# EAGLE design core3 (EAGLE 6.6.0)

## Sheet 1 of 2
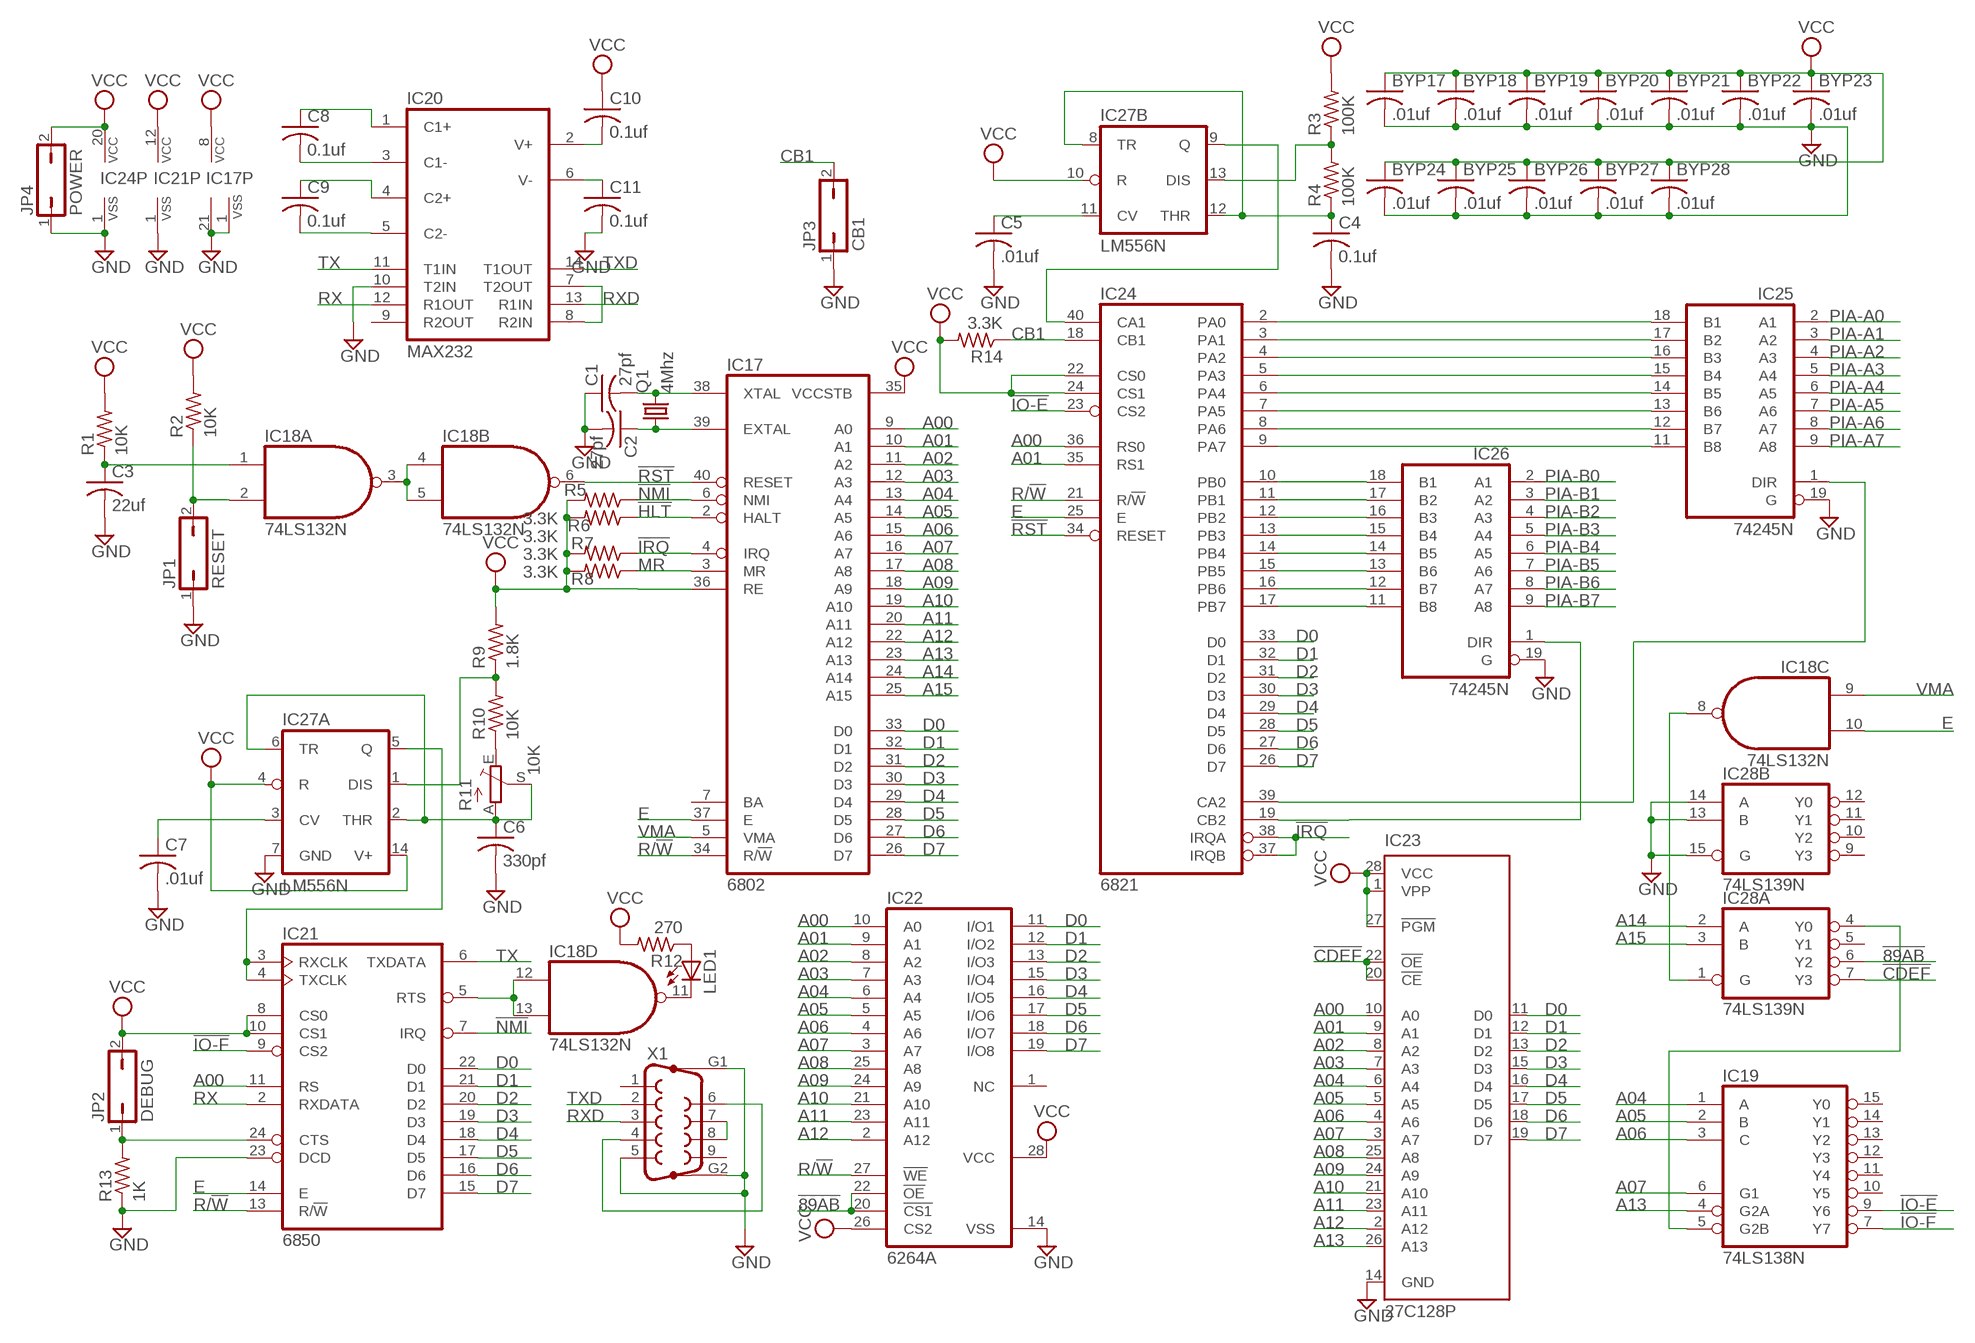
[diagram p0: schematic, sheet 1]

### Parts
BYP17  .01uf  C-US050-025X075  [C050-025X075]
BYP18  .01uf  C-US050-025X075  [C050-025X075]
BYP19  .01uf  C-US050-025X075  [C050-025X075]
BYP20  .01uf  C-US050-025X075  [C050-025X075]
BYP21  .01uf  C-US050-025X075  [C050-025X075]
BYP22  .01uf  C-US050-025X075  [C050-025X075]
BYP23  .01uf  C-US050-025X075  [C050-025X075]
BYP24  .01uf  C-US050-025X075  [C050-025X075]
BYP25  .01uf  C-US050-025X075  [C050-025X075]
BYP26  .01uf  C-US050-025X075  [C050-025X075]
BYP27  .01uf  C-US050-025X075  [C050-025X075]
BYP28  .01uf  C-US050-025X075  [C050-025X075]
C1  27pf  C-US050-025X075  [C050-025X075]
C2  27pf  C-US050-025X075  [C050-025X075]
C3  22uf  C-US102-043X133  [C102-043X133]
C4  0.1uf  C-US050-025X075  [C050-025X075]
C5  .01uf  C-US050-025X075  [C050-025X075]
C6  330pf  C-US050-025X075  [C050-025X075]
C7  .01uf  C-US050-025X075  [C050-025X075]
C8  0.1uf  C-US050-025X075  [C050-025X075]
C9  0.1uf  C-US050-025X075  [C050-025X075]
C10  0.1uf  C-US050-025X075  [C050-025X075]
C11  0.1uf  C-US050-025X075  [C050-025X075]
IC17  6802  [DIL40]
IC18  74LS132N  74LS00N  [DIL14]
IC19  74LS138N  [DIL16]
IC20  MAX232  [DIL16]
IC21  6850  [DIL24]
IC22  6264A  [DIL28-6]
IC23  27C128P  [DIL28-6]
IC24  6821  [DIL40]
IC25  74245N  74LS245N  [DIL20]
IC26  74245N  74LS245N  [DIL20]
IC27  LM556N  [DIL14]
IC28  74LS139N  [DIL16]
JP1  RESET  JP1Q  [JP1]
JP2  DEBUG  JP1Q  [JP1]
JP3  CB1  JP1Q  [JP1]
JP4  POWER  JP1Q  [JP1]
LED1  LED3MM  [LED3MM]
Q1  4Mhz  CRYSTALHC18U-V  [HC18U-V]
R1  10K  R-US_0207/7  [0207/7]
R2  10K  R-US_0207/7  [0207/7]
R3  100K  R-US_0207/7  [0207/7]
R4  100K  R-US_0207/7  [0207/7]
R5  3.3K  R-US_0207/7  [0207/7]
R6  3.3K  R-US_0207/7  [0207/7]
R7  3.3K  R-US_0207/7  [0207/7]
R8  3.3K  R-US_0207/7  [0207/7]
R9  1.8K  R-US_0207/7  [0207/7]
R10  10K  R-US_0207/7  [0207/7]
R11  10K  TRIM_EU-B90P  [SP19L]
R12  270  R-US_0207/7  [0207/7]
R13  1K  R-US_0207/7  [0207/7]
R14  3.3K  R-US_0207/7  [0207/7]
X1  F09HP  [F09HP]

### Nets
!89AB: IC22.20(!CS1) IC22.22(!OE) IC28.6(A:Y2)
!CDEF: IC23.20(!CE) IC23.22(!OE) IC28.7(A:Y3)
!HLT: IC17.2(HALT) R5.1
!IO-E: IC19.9(Y6) IC24.23(CS2)
!IO-F: IC19.7(Y7) IC21.9(CS2)
!IRQ: IC17.4(IRQ) IC24.37(IRQB) IC24.38(IRQA) R7.1
!NMI: IC17.6(NMI) IC21.7(IRQ) R6.1
!RST: IC17.40(RESET) IC18.6(B:O) IC24.34(RESET)
A00: IC17.9(A0) IC21.11(RS) IC22.10(A0) IC23.10(A0) IC24.36(RS0)
A01: IC17.10(A1) IC22.9(A1) IC23.9(A1) IC24.35(RS1)
A02: IC17.11(A2) IC22.8(A2) IC23.8(A2)
A03: IC17.12(A3) IC22.7(A3) IC23.7(A3)
A04: IC17.13(A4) IC19.1(A) IC22.6(A4) IC23.6(A4)
A05: IC17.14(A5) IC19.2(B) IC22.5(A5) IC23.5(A5)
A06: IC17.15(A6) IC19.3(C) IC22.4(A6) IC23.4(A6)
A07: IC17.16(A7) IC19.6(G1) IC22.3(A7) IC23.3(A7)
A08: IC17.17(A8) IC22.25(A8) IC23.25(A8)
A09: IC17.18(A9) IC22.24(A9) IC23.24(A9)
A10: IC17.19(A10) IC22.21(A10) IC23.21(A10)
A11: IC17.20(A11) IC22.23(A11) IC23.23(A11)
A12: IC17.22(A12) IC22.2(A12) IC23.2(A12)
A13: IC17.23(A13) IC19.4(G2A) IC23.26(A13)
A14: IC17.24(A14) IC28.2(A:A)
A15: IC17.25(A15) IC28.3(A:B)
CB1: IC24.18(CB1) JP3.2 R14.1
D0: IC17.33(D0) IC21.22(D0) IC22.11(I/O1) IC23.11(D0) IC24.33(D0)
D1: IC17.32(D1) IC21.21(D1) IC22.12(I/O2) IC23.12(D1) IC24.32(D1)
D2: IC17.31(D2) IC21.20(D2) IC22.13(I/O3) IC23.13(D2) IC24.31(D2)
D3: IC17.30(D3) IC21.19(D3) IC22.15(I/O4) IC23.15(D3) IC24.30(D3)
D4: IC17.29(D4) IC21.18(D4) IC22.16(I/O5) IC23.16(D4) IC24.29(D4)
D5: IC17.28(D5) IC21.17(D5) IC22.17(I/O6) IC23.17(D5) IC24.28(D5)
D6: IC17.27(D6) IC21.16(D6) IC22.18(I/O7) IC23.18(D6) IC24.27(D6)
D7: IC17.26(D7) IC21.15(D7) IC22.19(I/O8) IC23.19(D7) IC24.26(D7)
E: IC17.37(E) IC18.10(C:I1) IC21.14(E) IC24.25(E)
GND [Power]: BYP17.2 BYP18.2 BYP19.2 BYP20.2 BYP21.2 BYP22.2 BYP23.2 BYP24.2 BYP25.2 BYP26.2 BYP27.2 BYP28.2 C1.1 C2.2 C3.2 C4.2 C5.2 C6.2 C7.2 C11.2 IC17.1(VSS) IC17.21(VSS) IC20.10(T2IN) IC21.1(VSS) IC21.23(DCD) IC22.14(VSS) IC23.14(GND) IC24.1(VSS) IC25.19(G) IC26.19(G) IC27.7(A:GND) IC28.13(B:B) IC28.14(B:A) IC28.15(B:G) JP1.1 JP3.1 JP4.1 R13.1 X1.5 X1.G1 X1.G2 ; also sheet 2
MR: IC17.3(MR) R8.1
N$3: C2.1 IC17.39(EXTAL) Q1.1
N$4: C1.2 IC17.38(XTAL) Q1.2
N$5: IC24.2(PA0) IC25.18(B1)
N$6: IC18.3(A:O) IC18.4(B:I0) IC18.5(B:I1)
N$21: C3.1 IC18.1(A:I0) R1.1
N$22: IC18.2(A:I1) JP1.2 R2.1
N$23: IC21.3(RXCLK) IC21.4(TXCLK) IC27.5(A:Q)
N$24: IC24.10(PB0) IC26.18(B1)
N$25: IC24.11(PB1) IC26.17(B2)
N$27: C6.1 IC27.2(A:THR) IC27.6(A:TR) R11.A R11.S
N$28: IC27.1(A:DIS) R9.1 R10.2
N$94: IC24.12(PB2) IC26.16(B3)
N$124: IC24.13(PB3) IC26.15(B4)
N$125: IC24.14(PB4) IC26.14(B5)
N$126: IC24.15(PB5) IC26.13(B6)
N$127: IC24.16(PB6) IC26.12(B7)
N$128: IC24.17(PB7) IC26.11(B8)
N$129: IC24.3(PA1) IC25.17(B2)
N$130: IC24.4(PA2) IC25.16(B3)
N$131: IC24.5(PA3) IC25.15(B4)
N$132: IC24.6(PA4) IC25.14(B5)
N$133: IC24.7(PA5) IC25.13(B6)
N$134: IC24.8(PA6) IC25.12(B7)
N$135: IC24.9(PA7) IC25.11(B8)
N$136: IC24.19(CB2) IC26.1(DIR)
N$137: IC24.39(CA2) IC25.1(DIR)
N$138: IC24.40(CA1) IC27.9(B:Q)
N$140: C4.1 IC27.8(B:TR) IC27.12(B:THR) R4.1
N$141: IC27.13(B:DIS) R3.1 R4.2
N$142: C5.1 IC27.11(B:CV)
N$143: R10.1 R11.E
N$144: X1.4 X1.6
N$145: X1.7 X1.8
N$147: IC18.12(D:I0) IC18.13(D:I1) IC21.5(RTS)
N$148: IC18.11(D:O) LED1.K(C)
N$149: LED1.A R12.1
N$150: IC21.24(CTS) JP2.1 R13.2
N$151: IC18.8(C:O) IC28.1(A:G)
N$152: IC19.5(G2B) IC28.4(A:Y0)
N$153: IC20.7(T2OUT) IC20.8(R2IN)
N$154: C7.1 IC27.3(A:CV)
N$155: C9.2 IC20.5(C2-)
N$156: C9.1 IC20.4(C2+)
N$157: C8.2 IC20.3(C1-)
N$158: C8.1 IC20.1(C1+)
N$159: C11.1 IC20.6(V-)
N$160: C10.2 IC20.2(V+)
PIA-A0: IC25.2(A1) ; also sheet 2
PIA-A1: IC25.3(A2) ; also sheet 2
PIA-A2: IC25.4(A3) ; also sheet 2
PIA-A3: IC25.5(A4) ; also sheet 2
PIA-A4: IC25.6(A5) ; also sheet 2
PIA-A5: IC25.7(A6) ; also sheet 2
PIA-A6: IC25.8(A7) ; also sheet 2
PIA-A7: IC25.9(A8) ; also sheet 2
PIA-B0: IC26.2(A1) ; also sheet 2
PIA-B1: IC26.3(A2) ; also sheet 2
PIA-B2: IC26.4(A3) ; also sheet 2
PIA-B3: IC26.5(A4) ; also sheet 2
PIA-B4: IC26.6(A5) ; also sheet 2
PIA-B5: IC26.7(A6) ; also sheet 2
PIA-B6: IC26.8(A7) ; also sheet 2
PIA-B7: IC26.9(A8) ; also sheet 2
R/!W: IC17.34(R/!W) IC21.13(R/!W) IC22.27(!WE) IC24.21(R/!W)
RX: IC20.12(R1OUT) IC21.2(RXDATA)
RXD: IC20.13(R1IN) X1.3
TX: IC20.11(T1IN) IC21.6(TXDATA)
TXD: IC20.14(T1OUT) X1.2
VCC [Power]: BYP17.1 BYP18.1 BYP19.1 BYP20.1 BYP21.1 BYP22.1 BYP23.1 BYP24.1 BYP25.1 BYP26.1 BYP27.1 BYP28.1 C10.1 IC17.8(VCC) IC17.35(VCCSTB) IC17.36(RE) IC21.8(CS0) IC21.10(CS1) IC21.12(VCC) IC22.26(CS2) IC22.28(VCC) IC23.1(VPP) IC23.27(!PGM) IC23.28(VCC) IC24.20(VCC) IC24.22(CS0) IC24.24(CS1) IC27.4(A:R) IC27.10(B:R) IC27.14(A:V+) JP2.2 JP4.2 R1.2 R2.2 R3.2 R5.2 R6.2 R7.2 R8.2 R9.2 R12.2 R14.2 ; also sheet 2
VMA: IC17.5(VMA) IC18.9(C:I0)
Unconnected: IC17.7(BA) IC19.10(Y5) IC19.11(Y4) IC19.12(Y3) IC19.13(Y2) IC19.14(Y1) IC19.15(Y0) IC20.9(R2OUT) IC22.1(NC) IC28.5(A:Y1) IC28.9(B:Y3) IC28.10(B:Y2) IC28.11(B:Y1) IC28.12(B:Y0) X1.1 X1.9

## Sheet 2 of 2
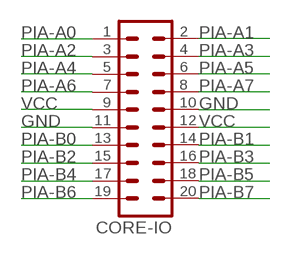
[diagram p1: schematic, sheet 2]

### Parts
CORE-IO  MA10-2  [MA10-2]

### Nets
GND [Power]: CORE-IO.10 CORE-IO.11 ; also sheet 1
PIA-A0: CORE-IO.1 ; also sheet 1
PIA-A1: CORE-IO.2 ; also sheet 1
PIA-A2: CORE-IO.3 ; also sheet 1
PIA-A3: CORE-IO.4 ; also sheet 1
PIA-A4: CORE-IO.5 ; also sheet 1
PIA-A5: CORE-IO.6 ; also sheet 1
PIA-A6: CORE-IO.7 ; also sheet 1
PIA-A7: CORE-IO.8 ; also sheet 1
PIA-B0: CORE-IO.13 ; also sheet 1
PIA-B1: CORE-IO.14 ; also sheet 1
PIA-B2: CORE-IO.15 ; also sheet 1
PIA-B3: CORE-IO.16 ; also sheet 1
PIA-B4: CORE-IO.17 ; also sheet 1
PIA-B5: CORE-IO.18 ; also sheet 1
PIA-B6: CORE-IO.19 ; also sheet 1
PIA-B7: CORE-IO.20 ; also sheet 1
VCC [Power]: CORE-IO.9 CORE-IO.12 ; also sheet 1

## Power pins joined to a net without a drawn wire
GND: IC18.7(P:GND) IC19.8(GND) IC20.15(GND) IC25.10(GND) IC26.10(GND) IC28.8(P:GND)
VCC: IC18.14(P:VCC) IC19.16(VCC) IC20.16(VCC) IC25.20(VCC) IC26.20(VCC) IC28.16(P:VCC)

## Library data of the parts
BYP17-BYP28 C1-C11 = rcl:C-US: CAPACITOR, American symbol
CORE-IO = con-lstb:MA10-2: PIN HEADER; OC_FARNELL: unknown; OC_NEWARK: unknown
IC17 = micro-motorola:6802: MICROCONTROLLER/MEMORY DEVICE; OC_FARNELL: unknown; OC_NEWARK: unknown
IC18 = 74xx-us:74*00: Quad 2-input NAND gate
IC19 = 74xx-us:74*138: 3-line to 8-line DECODER/DEMULTIPLEXER
IC20 = maxim:MAX232: RS232 TRANSCEIVER; MF: MAXIM; MPN: MAX232ACPE+; OC_FARNELL: 9723773; OC_NEWARK: 68K4544
IC21 = micro-motorola:6850: MICROCONTROLLER/MEMORY DEVICE; MF: NTE ELECTRONICS; MPN: NTE6850; OC_FARNELL: 4899775; OC_NEWARK: 31C2457
IC22 = memory-hitachi:6264A: MEMORY; OC_FARNELL: 283605; OC_NEWARK: unknown
IC23 = microchip:27*128: CMOS EPROM 128 K (16 K x 8); OC_FARNELL: unknown; OC_NEWARK: unknown
IC24 = micro-motorola:6821: MICROCONTROLLER/MEMORY DEVICE; MF: NTE ELECTRONICS; MPN: NTE6821; OC_FARNELL: 1652403; OC_NEWARK: 29C4772
IC25 IC26 = 74xx-us:74*245: Octal BUS TRANSCEIVER, 3-state
IC27 = linear:*556: Dual TIMER
IC28 = 74xx-us:74*139: Dual 2-line to 4-line DECODER/DEMULTIPLEXER
JP1-JP4 = jumper:JP1Q: JUMPER
LED1 = led:LED: LED OSRAM: - CHIPLED LG R971, LG N971, LY N971, LG Q971, LY Q971, LO R971, LY R971 LH N974, LH R974 LS Q976, LO Q976, LY Q976 LO Q996 - Hyper CHIPLED LW Q18S LB Q993, LB Q99A, LB R99A - SideLED LS A670, LO A670, LY A670, LG A670, LP A670 LB A673, LV A673, LT A673, LW A673 LH A674 LY A675 LS A676, LA A676, LO A676, LY A676, LW A676 LS A679, LY A679, LG A679 - Hyper Micro SIDELED® LS Y876, LA Y876, LO Y876, LY Y876 LT Y87S - SmartLED LW L88C, LW L88S LB L89C, LB L89S, LG L890 LS L89K, LO L89K, LY L89K LS L896, LA L896, LO L896, LY L896 - TOPLED LS T670, LO T670, LY T670, LG T670, LP T670 LSG T670, LSP T670, LSY T670, LOP T670, LYG T670 LG T671, LOG T671, LSG T671 LB T673, LV T673, LT T673, LW T673 LH T674 LS T676, LA T676, LO T676, LY T676, LB T676, LH T676, LSB T676, LW T676 LB T67C, LV T67C, LT T67C, LS T67K, LO T67K, LY T67K, LW E67C LS E67B, LA E67B, LO E67B, LY E67B, LB E67C, LV E67C, LT E67C LW T67C LS T679, LY T679, LG T679 LS T770, LO T770, LY T770, LG T770, LP T770 LB T773, LV T773, LT T773, LW T773 LH T774 LS E675, LA E675, LY E675, LS T675 LS T776, LA T776, LO T776, LY T776, LB T776 LHGB T686 LT T68C, LB T68C - Hyper Mini TOPLED® LB M676 - Mini TOPLED Santana® LG M470 LS M47K, LO M47K, LY M47K Source: http://www.osram.convergy.de LUXEON: - LUMILED® LXK2-PW12-R00, LXK2-PW12-S00, LXK2-PW14-U00, LXK2-PW14-V00 LXK2-PM12-R00, LXK2-PM12-S00, LXK2-PM14-U00 LXK2-PE12-Q00, LXK2-PE12-R00, LXK2-PE12-S00, LXK2-PE14-T00, LXK2-PE14-U00 LXK2-PB12-K00, LXK2-PB12-L00, LXK2-PB12-M00, LXK2-PB14-N00, LXK2-PB14-P00, LXK2-PB14-Q00 LXK2-PR12-L00, LXK2-PR12-M00, LXK2-PR14-Q00, LXK2-PR14-R00 LXK2-PD12-Q00, LXK2-PD12-R00, LXK2-PD12-S00 LXK2-PH12-R00, LXK2-PH12-S00 LXK2-PL12-P00, LXK2-PL12-Q00, LXK2-PL12-R00 Source: www.luxeon.com KINGBRIGHT: KA-3528ASYC Source: www.kingbright.com
Q1 = crystal:CRYSTAL: CRYSTAL; OC_FARNELL: unknown; OC_NEWARK: unknown
R1-R10 R12-R14 = rcl:R-US_: RESISTOR, American symbol
R11 = pot:TRIM_EU-: POTENTIOMETER
X1 = con-subd:F09HP: SUB-D; OC_FARNELL: unknown; OC_NEWARK: unknown

## Net classes
1 Power: width 0.508 mm, drill 0.254 mm, clearance 0.254 mm

## Board
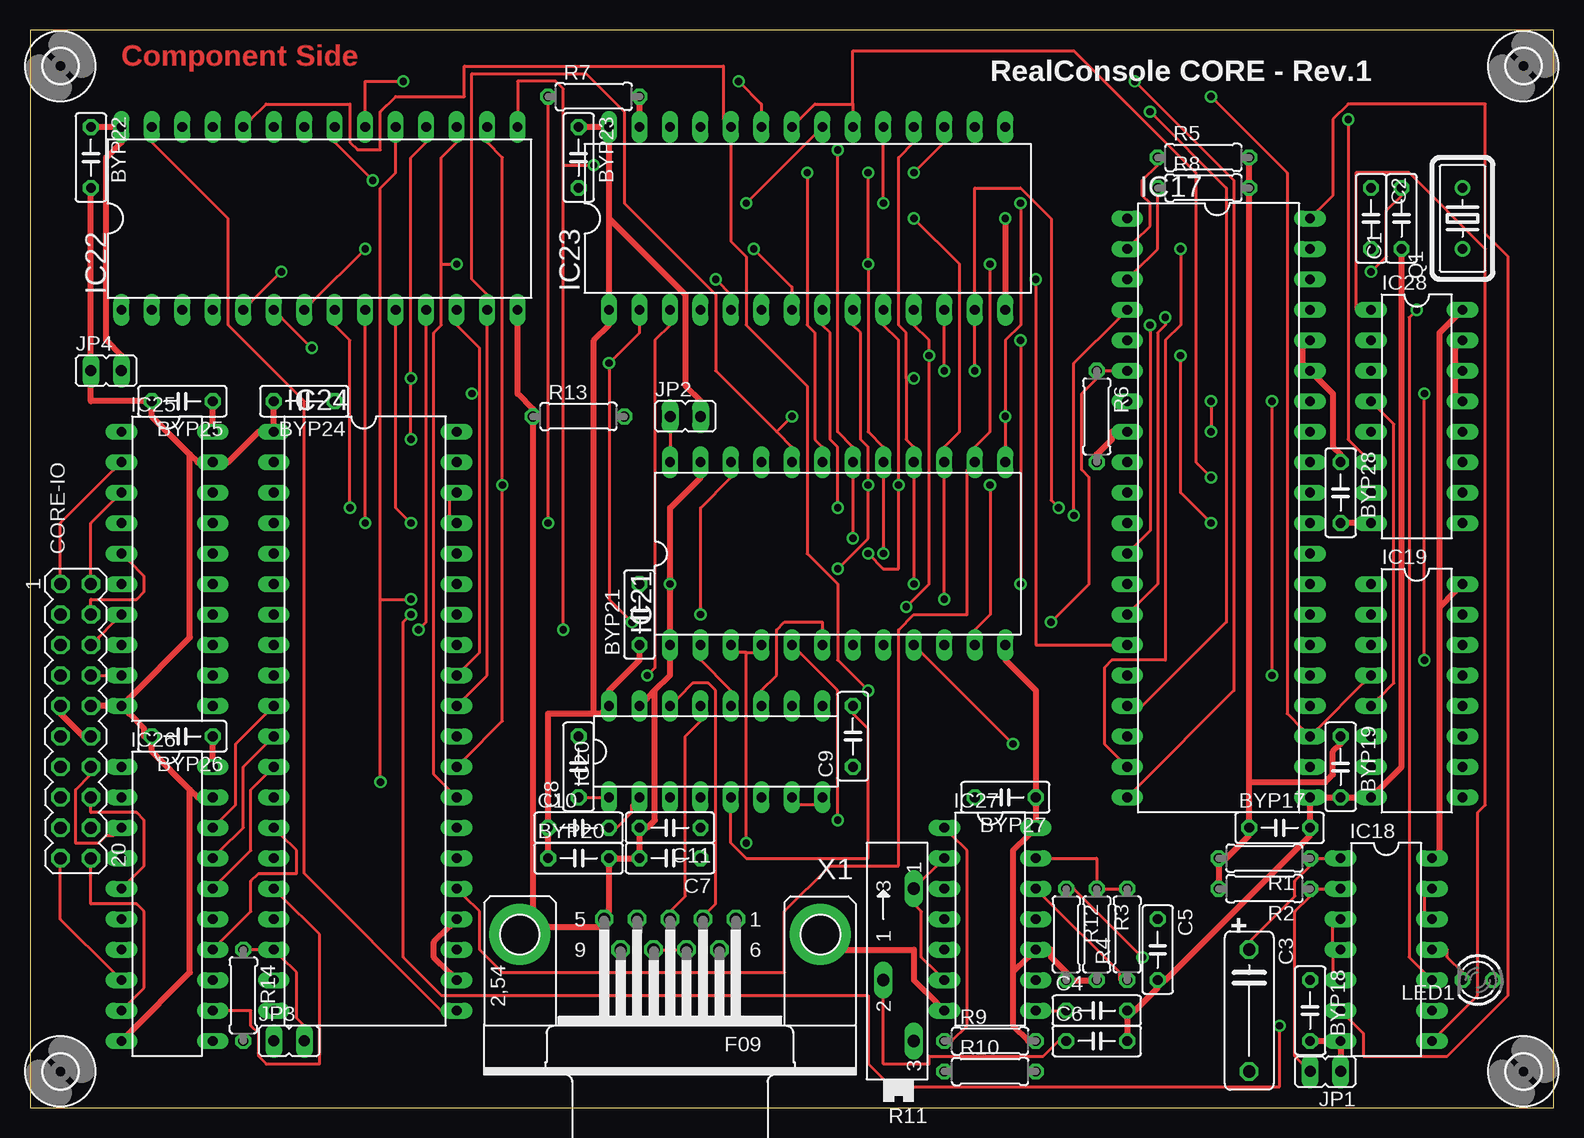
[diagram p2: board, top side]
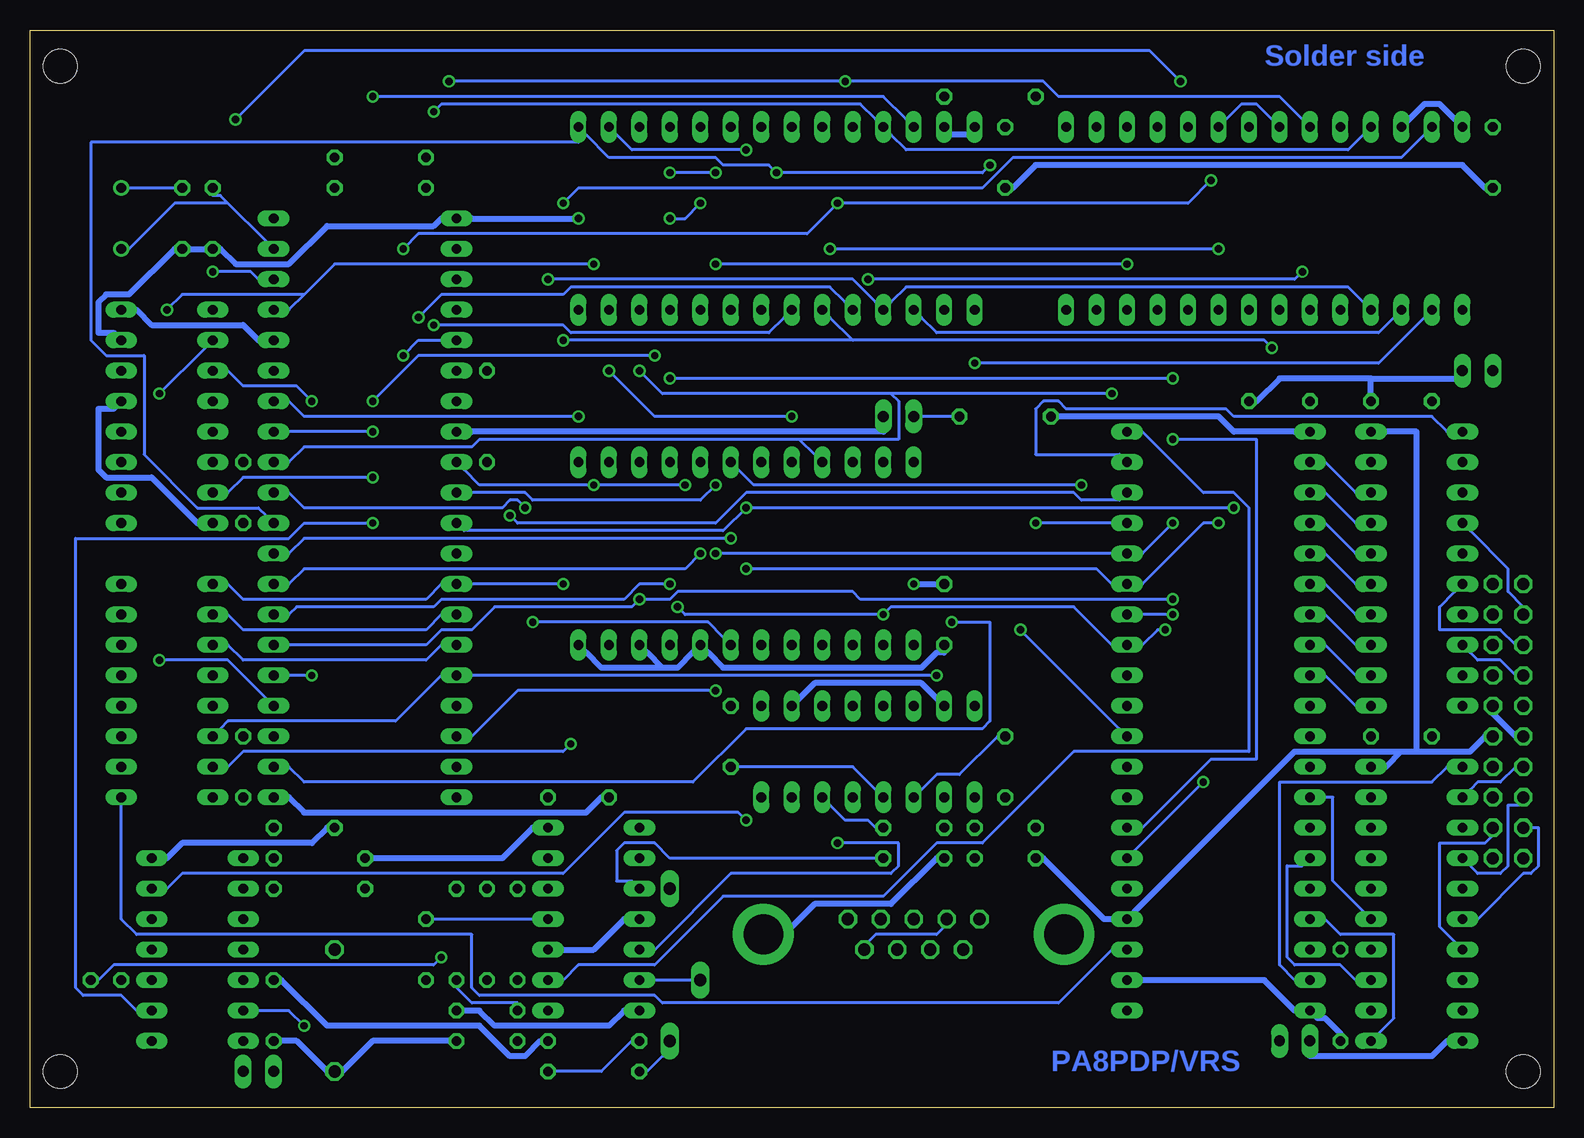
[diagram p3: board, bottom side, seen from below]

Size 126.98 x 89.84 mm. Coordinates in mm from the lower left corner, seen from the top.
Outline: 0,0 126.98,0 126.98,89.84 0,89.84 0,0
Copper layers (1*16): Top 0.035mm / dielectric 1.5mm / Bottom 0.035mm
Design rules "olimex10mil": minimum track width 10mil, minimum drill 24mil, track to track 10mil, track to pad 10mil, pad to pad 10mil, via to via 10mil, smd to smd 10mil, copper to edge 40mil, drill to drill 10mil, minimum pad ring 10mil, minimum via ring 8mil, stop-mask expansion 0mil, vias tented up to drill 0mil, thermal gap 10mil

### Footprints (pad centres in the part's own frame; a part is rotated, then mirrored left to right if it is on the bottom)
C050-025X075 = drill 0.813 octagon: 1 -2.54,0; 2 2.54,0
C102-043X133 = drill 1.016 octagon: 1 -5.08,0; 2 5.08,0
MA10-2 = drill 1.016 octagon: 1 -11.43,-1.27; 2 -11.43,1.27; 3 -8.89,-1.27; 4 -8.89,1.27; 5 -6.35,-1.27; 6 -6.35,1.27; 7 -3.81,-1.27; 8 -3.81,1.27; 9 -1.27,-1.27; 10 -1.27,1.27; 11 1.27,-1.27; 12 1.27,1.27; 13 3.81,-1.27; 14 3.81,1.27; 15 6.35,-1.27; 16 6.35,1.27; 17 8.89,-1.27; 18 8.89,1.27; 19 11.43,-1.27; 20 11.43,1.27
DIL40 = drill 0.813 long: 1 -24.13,-7.62; 2 -21.59,-7.62; 3 -19.05,-7.62; 4 -16.51,-7.62; 5 -13.97,-7.62; 6 -11.43,-7.62; 7 -8.89,-7.62; 8 -6.35,-7.62; 9 -3.81,-7.62; 10 -1.27,-7.62; 11 1.27,-7.62; 12 3.81,-7.62; 13 6.35,-7.62; 14 8.89,-7.62; 15 11.43,-7.62; 16 13.97,-7.62; 17 16.51,-7.62; 18 19.05,-7.62; 19 21.59,-7.62; 20 24.13,-7.62; 21 24.13,7.62; 22 21.59,7.62; 23 19.05,7.62; 24 16.51,7.62; 25 13.97,7.62; 26 11.43,7.62; 27 8.89,7.62; 28 6.35,7.62; 29 3.81,7.62; 30 1.27,7.62; 31 -1.27,7.62; 32 -3.81,7.62; 33 -6.35,7.62; 34 -8.89,7.62; 35 -11.43,7.62; 36 -13.97,7.62; 37 -16.51,7.62; 38 -19.05,7.62; 39 -21.59,7.62; 40 -24.13,7.62
DIL14 = drill 0.813 long: 1 -7.62,-3.81; 2 -5.08,-3.81; 3 -2.54,-3.81; 4 0,-3.81; 5 2.54,-3.81; 6 5.08,-3.81; 7 7.62,-3.81; 8 7.62,3.81; 9 5.08,3.81; 10 2.54,3.81; 11 0,3.81; 12 -2.54,3.81; 13 -5.08,3.81; 14 -7.62,3.81
DIL16 = drill 0.813 long: 1 -8.89,-3.81; 2 -6.35,-3.81; 3 -3.81,-3.81; 4 -1.27,-3.81; 5 1.27,-3.81; 6 3.81,-3.81; 7 6.35,-3.81; 8 8.89,-3.81; 9 8.89,3.81; 10 6.35,3.81; 11 3.81,3.81; 12 1.27,3.81; 13 -1.27,3.81; 14 -3.81,3.81; 15 -6.35,3.81; 16 -8.89,3.81
DIL24 = drill 0.813 long: 1 -13.97,-7.62; 2 -11.43,-7.62; 3 -8.89,-7.62; 4 -6.35,-7.62; 5 -3.81,-7.62; 6 -1.27,-7.62; 7 1.27,-7.62; 8 3.81,-7.62; 9 6.35,-7.62; 10 8.89,-7.62; 11 11.43,-7.62; 12 13.97,-7.62; 13 13.97,7.62; 14 11.43,7.62; 15 8.89,7.62; 16 6.35,7.62; 17 3.81,7.62; 18 1.27,7.62; 19 -1.27,7.62; 20 -3.81,7.62; 21 -6.35,7.62; 22 -8.89,7.62; 23 -11.43,7.62; 24 -13.97,7.62
DIL28-6 = drill 0.813 long: 1 -16.51,-7.62; 2 -13.97,-7.62; 3 -11.43,-7.62; 4 -8.89,-7.62; 5 -6.35,-7.62; 6 -3.81,-7.62; 7 -1.27,-7.62; 8 1.27,-7.62; 9 3.81,-7.62; 10 6.35,-7.62; 11 8.89,-7.62; 12 11.43,-7.62; 13 13.97,-7.62; 14 16.51,-7.62; 15 16.51,7.62; 16 13.97,7.62; 17 11.43,7.62; 18 8.89,7.62; 19 6.35,7.62; 20 3.81,7.62; 21 1.27,7.62; 22 -1.27,7.62; 23 -3.81,7.62; 24 -6.35,7.62; 25 -8.89,7.62; 26 -11.43,7.62; 27 -13.97,7.62; 28 -16.51,7.62
DIL20 = drill 0.813 long: 1 -11.43,-3.81; 2 -8.89,-3.81; 3 -6.35,-3.81; 4 -3.81,-3.81; 5 -1.27,-3.81; 6 1.27,-3.81; 7 3.81,-3.81; 8 6.35,-3.81; 9 8.89,-3.81; 10 11.43,-3.81; 11 11.43,3.81; 12 8.89,3.81; 13 6.35,3.81; 14 3.81,3.81; 15 1.27,3.81; 16 -1.27,3.81; 17 -3.81,3.81; 18 -6.35,3.81; 19 -8.89,3.81; 20 -11.43,3.81
JP1 = drill 0.914 long: 1 0,-1.27; 2 0,1.27
LED3MM = drill 0.813 octagon: A -1.27,0; K 1.27,0
HC18U-V = drill 0.813: 1 -2.54,0; 2 2.54,0
0207/7 = drill 0.813 octagon: 1 -3.81,0; 2 3.81,0
SP19L = drill 1.016 long: A 5.715,-1.27; E -6.985,-1.27; S -1.905,1.27
2,8 = hole 2.8: 0,0
F09HP = drill 1.016 octagon: 1 -5.486,-1.27; 2 -2.743,-1.27; 3 0,-1.27; 4 2.743,-1.27; 5 5.486,-1.27; 6 -4.115,1.27; 7 -1.372,1.27; 8 1.372,1.27; 9 4.115,1.27 | drill 3.302 pad 5.08: G1 -12.522,0; G2 12.522,0

### Placement (x,y rotation side)
BYP17  104.14,23.33 0 top
BYP18  106.68,8.09 270 top
BYP19  109.22,28.41 270 top
BYP20  45.71,20.79 0 top
BYP21  50.79,41.11 90 top
BYP22  5.08,79.21 270 top
BYP23  45.71,79.21 270 top
BYP24  22.86,58.89 180 top
BYP25  12.69,58.89 180 top
BYP26  12.69,30.95 180 top
BYP27  81.28,25.87 180 top
BYP28  109.22,51.27 270 top
C1  114.3,74.13 90 top
C2  111.76,74.13 270 top
C3  101.59,8.09 270 top
C4  88.9,8.09 0 top
C5  93.98,13.17 270 top
C6  88.9,5.55 0 top
C7  53.34,20.79 180 top
C8  45.71,28.41 90 top
C9  68.58,30.95 90 top
C10  45.71,23.33 0 top
C11  53.34,23.33 180 top
CORE-IO  3.81,32.22 270 top
IC17  99.06,50 270 top
IC18  113.03,13.17 270 top
IC19  115.56,34.76 270 top
IC20  57.14,29.68 0 top
IC21  67.31,46.19 0 top
IC22  24.12,74.13 0 top
IC23  64.77,74.13 0 top
IC24  27.94,32.22 270 top
IC25  11.42,44.92 270 top
IC26  11.42,16.98 270 top
IC27  80.01,15.71 270 top
IC28  115.56,57.62 270 top
JP1  107.95,3.01 90 top
JP2  54.6,57.62 270 top
JP3  21.59,5.55 270 top
JP4  6.34,61.43 270 top
LED1  120.65,10.63 180 top
Q1  119.38,74.13 90 top
R1  102.87,20.79 180 top
R2  102.87,18.25 180 top
R3  88.9,14.44 270 top
R4  91.44,14.44 90 top
R5  97.79,79.21 0 top
R6  88.9,57.62 270 top
R7  46.98,84.29 0 top
R8  97.79,76.67 0 top
R9  80.01,5.55 0 top
R10  80.01,3.01 0 top
R11  72.39,12.54 90 top
R12  86.36,14.44 270 top
R13  45.71,57.62 0 top
R14  17.78,9.36 270 top
U$3  [2,8]  2.54,86.83 0 top
U$4  [2,8]  2.54,3.01 0 top
U$5  [2,8]  124.45,86.83 0 top
U$6  [2,8]  124.45,3.01 0 top
X1  53.34,14.44 180 top

### Tracks (layer width: path | path; a pad name or v marks a point on that pad's centre or on a via)
!89AB  (via drill 0.61)
  Top 0.254: v109.85,82.39 109.85,55.71 111.12,54.45 IC28.6 | v31.11,85.56 27.94,85.56 27.94,83.02 IC22.20
  Bottom 0.254: IC22.22 23.49,82.39 24.76,83.66 26.03,83.66 27.3,82.39 IC22.20 | v109.85,82.39 104.14,88.1 33.65,88.1 v31.11,85.56
!CDEF  (via drill 0.61)
  Top 0.254: 68.58,83.66 65.4,83.66 64.13,82.39 IC23.22 | 68.58,83.66 68.58,83.02 IC23.20 | v98.42,52.54 97.15,53.81 97.15,77.94 86.99,88.1 68.58,88.1 68.58,83.66
  Bottom 0.254: v98.42,52.54 109.22,52.54 110.48,51.27 IC28.7
!HLT
  Top 0.254: IC17.2 92.07,72.22 93.34,73.5 93.34,75.4 92.7,76.03 92.7,77.3 93.98,78.58 R5.1
!IO-E
  Bottom 0.254: IC24.23 36.82,13.17 41.27,8.73 74.29,8.73 74.93,9.36 89.53,9.36 90.17,10 90.17,14.44 118.11,14.44 119.38,15.71 119.38,25.23 IC19.9
!IO-F  (via drill 0.61)
  Top 0.254: v81.91,30.31 74.29,37.94 IC21.9
  Bottom 0.254: v81.91,30.31 82.55,29.68 109.22,29.68 110.48,28.41 IC19.7
!IRQ  (via drill 0.61)
  Top 0.254: IC24.37 34.92,49.37 34.92,50.63 IC24.38 | v43.17,48.73 43.17,83.66 R7.1 | v86.99,49.37 86.99,62.06 90.8,65.88 IC17.4
  Bottom 0.254: v43.17,48.73 36.82,48.73 IC24.37 | v86.99,49.37 86.36,48.73 69.84,48.73 67.31,51.27 40,51.27 39.36,50.63 36.19,50.63 IC24.38
!NMI  (via drill 0.61)
  Top 0.254: v85.09,40.48 88.26,43.65 88.26,52.54 87.62,53.17 87.62,59.52 88.9,60.8 R6.1 89.53,61.43 90.17,61.43 IC17.6
  Bottom 0.254: v85.09,40.48 70.48,40.48 69.21,39.2 IC21.7
!RST  (via drill 0.61)
  Top 0.254: v31.75,41.11 31.11,40.48 31.11,12.54 34.28,9.36 69.84,9.36 69.84,3.64 71.75,1.74 104.14,1.74 v104.14,6.82 | IC17.40 107.31,74.77 108.58,76.03 108.58,82.39 109.85,83.66 121.28,83.66 121.28,72.86 123.19,70.95 123.19,9.36 118.11,4.28 111.12,4.28 111.12,6.18 109.85,7.46 IC18.6
  Bottom 0.254: v31.75,41.11 34.28,41.11 IC24.34 | v104.14,6.82 105.41,8.09 107.95,8.09 IC18.6
A00  (via drill 0.61)
  Top 0.254: v31.75,48.73 30.48,50 30.48,65.24 IC22.10 | v80.01,51.91 80.01,41.11 78.73,39.84 IC21.11 | IC23.10 71.12,65.24 72.39,63.97 v72.39,51.91 72.39,44.92 71.12,44.92 v69.84,46.19
  Bottom 0.254: v31.75,48.73 34.28,46.19 IC24.36 36.82,46.19 v69.84,46.19 | IC17.9 90.8,53.17 89.53,51.91 v80.01,51.91 v72.39,51.91
A01  (via drill 0.61)
  Top 0.254: v27.94,48.73 27.94,65.24 IC22.9 | IC23.9 68.58,65.24 69.21,64.61 69.21,55.71 69.84,55.08 v69.84,51.91 69.84,47.46 v67.31,44.92
  Bottom 0.254: v27.94,48.73 29.21,48.73 34.28,43.65 IC24.35 36.82,43.65 38.09,44.92 v67.31,44.92 | v69.84,51.91 71.12,50.63 85.09,50.63 85.72,51.27 90.17,51.27 IC17.10
A02  (via drill 0.61)
  Top 0.254: v26.67,50 26.67,63.97 25.39,65.24 IC22.8 | v67.31,50 67.31,55.08 66.67,55.71 66.67,64.61 66.04,65.24 IC23.8
  Bottom 0.254: v26.67,50 v67.31,50 69.21,48.09 90.8,48.09 IC17.11
A03  (via drill 0.61)
  Top 0.254: v27.94,71.59 23.49,67.14 IC22.7 | v60.32,71.59 63.49,68.41 63.49,67.78 IC23.7 | v93.34,65.24 93.34,48.09 92.07,46.82 IC17.12
  Bottom 0.254: v27.94,71.59 v60.32,71.59 | v93.34,65.24 82.55,65.24 81.91,64.61 65.4,64.61 64.13,65.88 IC23.7
A04  (via drill 0.61)
  Top 0.254: v23.49,63.34 20.95,65.88 IC22.6 | v82.55,63.97 v82.55,43.65
  Bottom 0.254: IC19.1 110.48,43.65 109.22,42.38 93.98,42.38 92.7,43.65 IC17.13 90.17,43.65 v82.55,43.65 | v23.49,63.34 24.12,63.97 58.41,63.97 | 58.41,63.97 60.32,65.88 IC23.6 | 58.41,63.97 v82.55,63.97
A05  (via drill 0.61)
  Top 0.254: v20.95,69.69 18.41,67.14 IC22.5 | v57.14,69.05 58.41,67.78 IC23.5 | v94.61,65.88 94.61,65.24 93.98,64.61 93.98,43.65 92.07,41.74 IC17.14
  Bottom 0.254: IC17.14 92.7,41.11 93.98,39.84 109.22,39.84 110.48,41.11 IC19.2 | v20.95,69.69 21.59,69.05 v57.14,69.05 | v94.61,65.88 92.7,67.78 82.55,67.78 81.91,68.41 60.32,68.41 59.05,67.14 IC23.5
A06  (via drill 0.61)
  Top 0.254: v83.81,69.05 83.81,38.57 90.17,38.57 IC17.15
  Bottom 0.254: IC17.15 92.7,38.57 93.98,37.3 109.22,37.3 110.48,38.57 IC19.3 | IC22.4 15.87,67.14 17.14,68.41 53.97,68.41 55.24,67.14 IC23.4 56.51,67.14 58.41,69.05 v83.81,69.05
A07  (via drill 0.61)
  Top 0.254: v51.43,36.03 52.06,36.66 52.06,63.97 53.34,65.24 IC23.3
  Bottom 0.254: IC19.6 111.12,31.58 110.48,32.22 96.52,32.22 92.7,36.03 IC17.16 90.17,36.03 v51.43,36.03 | IC22.3 13.33,65.88 14.6,64.61 51.43,64.61 52.7,65.88 IC23.3
A08  (via drill 0.61)
  Top 0.254: v93.34,83.02 99.69,76.67 99.69,40.48 92.7,33.49 IC17.17
  Bottom 0.254: IC22.25 15.87,81.11 17.14,79.84 53.97,79.84 55.24,81.11 IC23.25 56.51,82.39 57.78,83.66 92.7,83.66 v93.34,83.02
A09  (via drill 0.61)
  Top 0.254: IC22.24 18.41,82.39 19.68,83.66 26.67,83.66 26.67,80.48 27.3,79.84 29.21,79.84 29.21,83.02 30.48,84.29 36.19,84.29 36.19,86.83 57.78,86.83 57.78,82.39 IC23.24 58.41,80.48 58.41,72.22 59.68,70.95 59.68,65.24 64.77,60.16 64.77,46.19 67.31,43.65 67.31,37.3 v69.84,34.76
  Bottom 0.254: v69.84,34.76 86.36,34.76 90.17,30.95 IC17.18
A10  (via drill 0.61)
  Top 0.254: v28.57,77.3 25.39,80.48 IC22.21 | v59.68,75.4 65.4,81.11 IC23.21 | v95.88,71.59 95.88,65.24 94.61,63.97 94.61,37.3 90.17,37.3 89.53,36.66 89.53,30.31 90.8,29.04 IC17.19
  Bottom 0.254: v28.57,77.3 30.48,75.4 v59.68,75.4 62.22,72.86 94.61,72.86 v95.88,71.59
A11  (via drill 0.61)
  Top 0.254: v59.05,85.56 60.95,83.66 60.95,83.02 IC23.23 | v92.07,85.56 100.33,77.3 100.33,34.76 92.07,26.5 IC17.20
  Bottom 0.254: IC22.23 20.95,82.39 22.86,84.29 41.27,84.29 42.54,85.56 v59.05,85.56 v92.07,85.56
A12  (via drill 0.61)
  Top 0.254: IC23.2 50.79,65.24 50.79,64.61 v48.25,62.06 48.25,42.38 v50.16,40.48
  Bottom 0.254: v48.25,62.06 14.6,62.06 10.79,65.88 IC22.2 | v50.16,40.48 46.98,40.48 46.98,32.22 47.62,31.58 67.31,31.58 71.75,27.14 104.14,27.14 105.41,28.41 IC17.22
A13  (via drill 0.61)
  Top 0.254: v98.42,84.29 104.77,77.94 104.77,32.85 106.04,31.58 IC17.23 107.31,31.58 111.12,35.39 IC19.4
  Bottom 0.254: v98.42,84.29 55.88,84.29 53.97,82.39 IC23.26
A14  (via drill 0.61)
  Top 0.254: v116.2,37.3 v116.2,59.52
  Bottom 0.254: v116.2,37.3 110.48,37.3 107.31,34.12 IC17.24 | v116.2,59.52 112.39,63.34 IC28.2
A15  (via drill 0.61)
  Top 0.254: v103.5,36.03 v103.5,58.89
  Bottom 0.254: v103.5,36.03 105.41,36.03 IC17.25 | v103.5,58.89 104.77,60.16 109.22,60.16 110.48,61.43 IC28.3
CB1
  Top 0.254: R14.1 18.41,13.17 19.05,13.17 IC24.18 20.95,12.54 22.22,11.27 22.22,7.46 22.86,6.82 JP3.2
D0  (via drill 0.61)
  Top 0.254: v32.38,39.84 33.02,40.48 33.02,65.24 IC22.11 | v55.88,41.11 55.88,50 58.41,52.54 IC21.22 | v73.02,41.74 74.93,43.65 v74.93,62.7 74.93,63.97 73.66,65.24 IC23.11 | v98.42,58.89 v98.42,56.35
  Bottom 0.254: v32.38,39.84 33.02,39.84 34.28,38.57 IC24.33 36.82,38.57 40,41.74 55.24,41.74 v55.88,41.11 72.39,41.11 v73.02,41.74 | v98.42,56.35 105.41,56.35 IC17.33 | v98.42,58.89 94.61,62.7 v74.93,62.7
D1  (via drill 0.61)
  Top 0.254: 37.46,59.52 37.46,63.34 35.55,65.24 IC22.12 | 37.46,59.52 37.46,37.94 36.19,36.66 IC24.32 | v76.2,61.43 76.2,65.24 IC23.12 | 37.46,59.52 v36.82,59.52
  Bottom 0.254: 62.86,55.71 61.59,54.45 IC21.21 | 62.86,55.71 89.53,55.71 90.17,55.08 104.14,55.08 105.41,53.81 IC17.32 | v76.2,61.43 74.29,59.52 55.24,59.52 | 55.24,59.52 54.6,58.89 54.6,55.71 62.86,55.71 | v36.82,59.52 55.24,59.52
D2  (via drill 0.61)
  Top 0.254: IC24.31 36.19,34.12 38.09,36.03 38.09,65.24 IC22.13 38.09,67.78 36.82,69.05 36.82,86.19 46.35,86.19 49.52,83.02 49.52,75.4 57.14,67.78 57.14,61.43 62.22,56.35 | 62.22,56.35 63.49,55.08 IC21.20 | v78.73,61.43 78.73,65.24 IC23.13 78.73,67.78 78.73,76.67 82.55,76.67 85.09,74.13 85.09,50.63 v85.72,50 | 62.22,56.35 v63.49,57.62
  Bottom 0.254: v78.73,61.43 74.93,57.62 v63.49,57.62 | v85.72,50 86.36,50.63 86.99,50.63 87.62,50 104.14,50 105.41,51.27 IC17.31
D3  (via drill 0.61)
  Top 0.254: 44.45,78.58 44.45,84.92 43.81,85.56 40.63,85.56 40.63,83.02 IC22.15 | v44.45,39.84 44.45,78.58 | v64.77,77.94 64.77,65.24 65.4,64.61 65.4,55.71 66.04,55.08 IC21.19 | 44.45,78.58 v46.98,78.58
  Bottom 0.254: v44.45,39.84 36.19,31.58 IC24.30 | IC17.30 107.31,49.37 107.95,50 113.03,50 117.47,54.45 117.47,62.7 120.65,62.7 121.92,63.97 121.92,80.48 81.28,80.48 IC23.15 80.64,81.11 78.73,79.21 69.84,79.21 69.21,78.58 65.4,78.58 v64.77,77.94 47.62,77.94 v46.98,78.58
D4  (via drill 0.61)
  Top 0.254: IC24.29 36.19,29.04 39.36,32.22 v39.36,51.91 39.36,79.21 38.09,80.48 IC22.16 | v68.58,47.46 68.58,52.54 IC21.18 68.58,55.08 67.31,56.35 v67.31,79.84
  Bottom 0.254: v39.36,51.91 66.67,51.91 67.94,53.17 IC21.18 | v68.58,47.46 104.14,47.46 105.41,46.19 IC17.29 | v67.31,79.84 76.83,79.84 78.1,81.11 IC23.16
D5  (via drill 0.61)
  Top 0.254: 34.28,70.32 34.28,79.21 35.55,80.48 IC22.17 | 34.28,70.32 34.28,65.24 33.65,64.61 33.65,27.77 34.92,26.5 IC24.28 | v71.12,46.19 71.12,52.54 IC21.17 71.12,55.08 69.84,56.35 v69.84,70.32 v69.84,77.94 | v73.66,77.94 76.2,80.48 IC23.17 | 34.28,70.32 v35.55,70.32
  Bottom 0.254: v71.12,46.19 72.39,44.92 104.14,44.92 105.41,43.65 IC17.28 | v69.84,77.94 v73.66,77.94 | v35.55,70.32 v69.84,70.32
D6  (via drill 0.61)
  Top 0.254: v31.75,55.71 v31.75,60.8 31.75,79.21 33.02,80.48 IC22.18 | 73.02,60.8 73.02,64.61 72.39,65.24 72.39,79.21 73.66,80.48 IC23.18 | 73.02,60.8 73.02,55.71 73.66,55.08 IC21.16 73.66,52.54 v73.66,43.65 | v73.66,60.8 73.02,60.8
  Bottom 0.254: v31.75,55.71 24.76,55.71 24.76,29.04 28.57,29.04 34.28,23.33 IC24.27 | v73.66,43.65 76.2,43.65 77.47,42.38 92.7,42.38 93.34,41.74 104.77,41.74 105.41,41.11 IC17.27 | v31.75,60.8 v73.66,60.8
D7  (via drill 0.61)
  Top 0.254: 29.21,42.38 29.21,76.67 30.48,77.94 30.48,80.48 IC22.19 | v29.21,27.14 29.21,42.38 | v76.2,42.38 76.2,52.54 IC21.15 76.2,55.08 77.47,56.35 77.47,70.32 v73.66,74.13 | v71.12,75.4 71.12,80.48 IC23.19 | 29.21,42.38 v31.75,42.38
  Bottom 0.254: v29.21,27.14 34.92,21.42 IC24.26 | IC17.26 105.41,38.57 93.98,38.57 92.7,39.84 90.17,39.84 88.26,41.74 76.83,41.74 v76.2,42.38 73.66,42.38 73.02,43.02 58.41,43.02 57.78,42.38 v31.75,42.38 | v71.12,75.4 72.39,74.13 v73.66,74.13
E  (via drill 0.61)
  Top 0.254: IC24.25 36.19,17.61 37.46,16.34 37.46,13.17 39.36,11.27 62.86,11.27 62.86,16.34 66.67,20.15 72.39,20.15 72.39,39.84 73.66,41.11 78.1,41.11 78.1,53.17 IC21.14 78.73,55.08 80.01,56.35 v80.01,70.32 | v115.56,66.51 114.93,65.88 114.93,12.54 116.2,11.27 IC18.10
  Bottom 0.254: 104.14,67.78 101.59,70.32 v80.01,70.32 | 104.14,67.78 105.41,66.51 IC17.37 | v115.56,66.51 114.3,67.78 104.14,67.78
GND  (via drill 0.61)
  Top 0.508: IC25.10 6.34,33.49 5.71,33.49 CORE-IO.10 | 13.33,26.5 10.15,29.68 10.15,30.31 BYP26.2 9.52,30.95 9.52,31.58 8.25,32.85 IC25.10 | 13.33,26.5 13.96,25.87 IC26.19 | 13.33,26.5 13.33,11.27 8.25,6.18 IC26.10 | IC22.14 40.63,65.24 40.63,59.52 41.9,58.25 R13.1 41.9,56.98 41.9,16.34 X1.G2 43.17,15.08 47.62,15.08 X1.5 48.25,16.34 48.25,20.15 BYP20.2 48.89,20.79 50.16,20.79 C7.2 50.79,21.42 50.79,22.7 C11.2 51.43,23.33 52.06,23.96 52.06,34.76 | BYP24.2 20.32,58.25 20.32,56.98 IC24.1 19.05,56.35 16.51,53.81 IC25.19 13.96,53.81 13.33,54.45 | BYP22.2 5.08,76.03 5.08,62.7 JP4.1 5.08,60.16 5.08,58.89 9.52,58.89 BYP25.2 10.15,58.25 10.15,57.62 13.33,54.45 | 13.33,54.45 13.33,39.2 8.25,34.12 IC25.10 | 52.06,34.76 53.34,36.03 53.34,37.3 IC21.1 53.34,39.84 v53.34,43.65 53.34,50 55.88,52.54 IC21.23 | 52.06,34.76 51.43,34.12 IC20.15 | v81.28,74.13 81.28,67.78 IC23.14 | BYP28.2 109.85,48.73 110.48,48.73 IC28.8 | IC28.13 118.74,59.52 118.74,60.8 IC28.14 118.74,62.06 118.74,63.34 IC28.15 | BYP18.2 107.31,5.55 107.95,5.55 IC18.7 109.22,4.92 109.22,4.28 JP1.1 | C6.2 91.44,6.18 91.44,7.46 C4.2 92.07,8.09 93.98,10 C5.2 94.61,10.63 106.68,22.7 BYP17.2 106.68,23.96 106.68,25.23 IC17.21 107.95,25.87 108.58,25.87 BYP19.2 109.85,25.87 110.48,25.87 IC19.8 112.39,26.5 114.3,28.41 114.3,70.95 C1.1 | X1.G1 67.94,13.17 73.66,13.17 73.66,10.63 75.56,8.73 IC27.7
  Bottom 0.508: IC26.10 8.88,5.55 10.15,4.28 20.32,4.28 JP3.1 | BYP23.2 45.08,76.67 43.17,78.58 7.62,78.58 5.71,76.67 BYP22.2 | R13.1 41.27,57.62 27.94,57.62 26.67,56.35 21.59,56.35 IC24.1 | v53.34,43.65 51.43,43.65 BYP21.2 | IC20.10 62.86,34.12 61.59,35.39 52.7,35.39 51.43,34.12 IC20.15 | v81.28,74.13 90.17,74.13 IC17.1 92.7,74.13 93.34,73.5 102.23,73.5 105.41,70.32 109.85,70.32 111.12,71.59 C2.2 112.39,71.59 113.66,71.59 C1.1 114.93,71.59 118.74,67.78 120.65,67.78 121.28,67.14 121.28,64.61 120.01,64.61 IC28.15 | IC28.8 113.03,48.73 116.84,52.54 120.65,52.54 121.28,53.17 121.28,58.25 120.01,58.25 IC28.13 | BYP27.2 79.37,25.87 80.64,24.6 104.14,24.6 105.41,25.87 IC17.21 | BYP18.2 106.04,5.55 104.77,5.55 102.23,3.01 C3.2 100.96,3.01 98.42,5.55 92.07,5.55 C6.2 | IC27.7 77.47,8.09 78.73,6.82 88.26,6.82 89.53,8.09 90.8,8.09 C4.2 | C7.2 51.43,20.79 55.24,16.98 61.59,16.98 63.49,15.08 X1.G1 | CORE-IO.11 3.17,30.95 5.08,32.85 CORE-IO.10
MR
  Top 0.254: IC17.3 92.07,69.69 93.98,71.59 93.98,76.03 R8.1
N$3
  Bottom 0.254: 110.48,75.4 111.12,76.03 111.76,76.03 C2.1 | 110.48,75.4 107.31,72.22 IC17.39 | 110.48,75.4 114.93,75.4 118.74,71.59 Q1.1
N$4  (via drill 0.61)
  Top 0.254: v111.76,69.69 113.03,70.95 113.03,74.77 114.3,76.03 C1.2
  Bottom 0.254: v111.76,69.69 108.58,69.69 107.95,69.05 IC17.38 | Q1.2 118.74,76.67 114.93,76.67 C1.2
N$5
  Bottom 0.254: IC25.18 16.51,51.27 19.05,53.81 IC24.2
N$6
  Top 0.254: IC18.5 108.58,11.27 108.58,12.54 IC18.4 108.58,13.81 108.58,15.08 IC18.3
N$21
  Top 0.254: IC18.1 107.95,20.79 107.31,20.79 R1.1 106.68,20.15 105.41,18.88 105.41,17.61 101.59,13.81 C3.1
N$22
  Top 0.254: IC18.2 107.95,18.25 107.31,18.25 R2.1 106.68,17.61 105.41,16.34 105.41,4.28 106.04,3.64 JP1.2
N$23  (via drill 0.61)
  Top 0.254: 59.68,37.94 60.32,37.94 IC21.4 | 59.68,37.94 59.05,37.94 IC21.3 | v59.68,22.06 59.68,37.94
  Bottom 0.254: v59.68,22.06 54.6,22.06 54.6,20.15 55.24,19.52 68.58,19.52 74.93,13.17 IC27.5
N$24
  Top 0.254: IC26.18 15.87,23.96 17.14,25.23 17.14,30.31 19.68,32.85 IC24.10
N$25
  Top 0.254: IC26.17 15.87,21.42 17.78,23.33 17.78,28.41 19.68,30.31 IC24.11
N$27
  Top 0.254: IC27.2 75.56,20.15 74.29,18.88 R11.A 73.66,16.98 74.29,16.34 74.29,12.54 75.56,11.27 IC27.6 | C6.1 85.72,5.55 84.45,4.28 74.93,4.28 74.93,3.64 71.12,3.64 71.12,9.36 R11.S
  Bottom 0.254: IC27.6 74.93,10.63 71.75,10.63 R11.S
N$28
  Top 0.254: IC27.1 76.83,22.7 78.1,21.42 78.1,6.82 76.83,5.55 R9.1
  Bottom 0.254: R9.1 76.83,5.55 79.37,3.01 83.18,3.01 R10.2
N$94
  Top 0.254: IC26.16 15.87,18.88 18.41,21.42 18.41,26.5 19.68,27.77 IC24.12
N$124
  Bottom 0.254: IC26.15 15.87,16.34 18.41,18.88 18.41,25.87 19.05,25.87 IC24.13
N$125
  Top 0.254: IC26.14 15.87,13.81 18.41,16.34 18.41,18.88 19.05,19.52 22.22,19.52 22.22,21.42 20.95,22.7 IC24.14
N$126
  Bottom 0.254: IC26.13 16.51,10.63 17.78,11.9 21.59,11.9 22.22,12.54 22.22,20.15 20.95,20.15 IC24.15
N$127
  Top 0.254: IC26.12 16.51,8.09 18.41,8.09 18.41,6.82 19.05,6.18 19.05,4.28 19.68,3.64 24.12,3.64 24.12,14.44 20.95,17.61 IC24.16
N$128
  Bottom 0.254: IC26.11 14.6,6.18 13.33,7.46 13.33,14.44 17.78,14.44 19.05,15.71 IC24.17
N$129
  Bottom 0.254: IC25.17 16.51,48.73 19.05,51.27 IC24.3
N$130
  Bottom 0.254: IC25.16 16.51,46.19 19.05,48.73 IC24.4
N$131
  Bottom 0.254: IC25.15 16.51,43.65 19.05,46.19 IC24.5
N$132
  Bottom 0.254: IC25.14 16.51,41.11 19.05,43.65 IC24.6
N$133
  Bottom 0.254: IC25.13 16.51,38.57 19.05,41.11 IC24.7
N$134
  Bottom 0.254: IC25.12 16.51,36.03 19.05,38.57 IC24.8
N$135
  Bottom 0.254: IC25.11 16.51,33.49 19.05,36.03 IC24.9
N$136
  Bottom 0.254: IC24.19 21.59,10.63 22.86,11.9 22.86,27.14 10.15,27.14 8.88,28.41 IC26.1
N$137
  Bottom 0.254: IC25.1 8.88,56.35 10.15,57.62 26.67,57.62 27.3,58.25 40.63,58.25 41.27,58.89 42.54,58.89 43.17,58.25 43.17,54.45 36.19,54.45 IC24.39
N$138
  Bottom 0.254: IC24.40 34.28,56.35 29.21,51.27 26.67,51.27 25.39,50 25.39,29.68 40,29.68 47.62,22.06 51.43,22.06 55.88,17.61 69.21,17.61 74.93,11.9 81.28,11.9 82.55,10.63 IC27.9
N$140
  Top 0.254: IC27.8 85.09,8.09 85.72,8.09 C4.1 | IC27.12 84.45,17.61 90.8,11.27 90.8,10.63 R4.1
  Bottom 0.254: R4.1 91.44,10 90.17,8.73 86.36,8.73 C4.1
N$141
  Top 0.254: R4.2 90.8,18.25 89.53,18.25 R3.1 88.9,18.88 88.9,20.79 85.09,20.79 IC27.13
N$142
  Bottom 0.254: IC27.11 85.09,15.71 93.34,15.71 C5.1
N$143
  Bottom 0.254: R10.1 75.56,3.01 74.29,4.28 73.66,4.28 R11.E
N$144
  Bottom 0.254: X1.4 50.79,15.08 51.43,14.44 56.51,14.44 57.14,13.81 X1.6
N$145
  Top 0.254: X1.8 52.7,13.17 53.97,13.17 X1.7
N$147  (via drill 0.61)
  Top 0.254: IC18.12 116.2,16.34 116.2,17.61 IC18.13 | v67.31,23.96 67.31,34.76 64.13,37.94 IC21.5
  Bottom 0.254: v67.31,23.96 67.94,24.6 77.47,24.6 82.55,19.52 114.3,19.52 115.56,18.25 IC18.13
N$148
  Top 0.254: LED1.K 119.38,11.27 118.11,12.54 118.11,13.17 IC18.11
N$149  (via drill 0.61)
  Top 0.254: v92.7,12.54 86.99,18.25 R12.1
  Bottom 0.254: v92.7,12.54 93.34,11.9 120.01,11.9 121.28,10.63 LED1.A
N$150
  Top 0.254: IC21.24 53.34,55.08 53.34,56.35 JP2.1
  Bottom 0.254: R13.2 50.16,57.62 52.7,57.62 JP2.1
N$151
  Top 0.254: IC18.8 117.47,6.18 120.65,9.36 120.65,24.6 121.28,25.23 121.28,71.59 114.93,77.94 110.48,77.94 110.48,66.51 IC28.1
N$152
  Top 0.254: IC19.5 112.39,34.12 113.66,35.39 113.66,56.98 112.39,58.25 IC28.4
N$153
  Top 0.254: IC20.7 64.13,25.23 65.4,25.23 IC20.8
N$154
  Bottom 0.254: C7.1 56.51,20.79 73.66,20.79 74.93,22.06 77.47,22.06 78.1,21.42 78.1,18.88 76.83,18.88 IC27.3
N$155
  Top 0.254: IC20.5 58.41,24.6 58.41,22.06 59.68,20.79 69.84,20.79 69.84,31.58 68.58,32.85 C9.2
N$156
  Bottom 0.254: IC20.4 56.51,26.5 58.41,28.41 67.94,28.41 C9.1
N$157
  Bottom 0.254: C8.2 46.35,30.95 49.52,27.77 51.43,27.77 52.7,26.5 IC20.3
N$158
  Top 0.254: C8.1 46.35,25.87 47.62,25.87 IC20.1
N$159
  Bottom 0.254: C11.1 56.51,23.33 57.14,23.96 59.05,23.96 60.32,25.23 IC20.6
N$160
  Top 0.254: C10.2 48.89,23.33 50.16,24.6 50.16,25.23 IC20.2
PIA-A0
  Top 0.254: IC25.2 6.98,53.17 2.54,48.73 2.54,44.28 CORE-IO.1
PIA-A1
  Top 0.254: IC25.3 6.98,50.63 5.08,48.73 5.08,44.28 CORE-IO.2
PIA-A2
  Bottom 0.254: IC25.4 6.98,48.09 3.81,44.92 3.81,43.02 2.54,41.74 CORE-IO.3
PIA-A3
  Top 0.254: IC25.5 8.25,45.55 9.52,44.28 9.52,43.02 8.88,42.38 5.08,42.38 5.08,41.74 CORE-IO.4
PIA-A4
  Bottom 0.254: IC25.6 8.25,43.02 9.52,41.74 9.52,39.84 4.44,39.84 3.17,38.57 CORE-IO.5
PIA-A5
  Top 0.254: IC25.7 6.98,40.48 5.71,39.2 5.71,38.57 CORE-IO.6
PIA-A6
  Bottom 0.254: IC25.8 6.98,37.94 6.34,37.3 4.44,37.3 3.17,36.03 CORE-IO.7
PIA-A7
  Top 0.254: IC25.9 6.34,36.03 5.71,36.03 CORE-IO.8
PIA-B0
  Bottom 0.254: IC26.2 6.98,26.5 6.34,27.14 4.44,27.14 3.17,28.41 CORE-IO.13
PIA-B1
  Top 0.254: IC26.3 6.98,22.7 6.34,22.7 5.71,22.06 3.81,22.06 3.81,26.5 5.08,27.77 CORE-IO.14
PIA-B2
  Bottom 0.254: IC26.4 6.98,20.15 6.34,19.52 4.44,19.52 3.81,20.15 3.81,25.23 2.54,25.23 CORE-IO.15
PIA-B3
  Top 0.254: IC26.5 8.25,18.88 9.52,20.15 9.52,23.96 8.88,24.6 5.08,24.6 5.08,25.23 CORE-IO.16
PIA-B4
  Bottom 0.254: IC26.6 6.34,15.71 2.54,19.52 1.9,19.52 1.27,20.15 1.27,23.33 1.9,23.33 CORE-IO.17
PIA-B5
  Bottom 0.254: IC26.7 8.25,13.81 9.52,15.08 9.52,22.06 5.71,22.06 5.08,22.7 CORE-IO.18
PIA-B6
  Top 0.254: IC26.8 6.98,11.27 2.54,15.71 2.54,20.15 CORE-IO.19
PIA-B7
  Top 0.254: IC26.9 8.25,8.73 9.52,10 9.52,16.34 8.88,16.98 5.08,16.98 5.08,20.15 CORE-IO.20
R/!W  (via drill 0.61)
  Top 0.254: IC21.13 81.28,55.08 v81.28,57.62 81.28,63.97 82.55,65.24 v82.55,75.4 | IC24.21 34.28,8.09 22.86,19.52 22.86,58.89 16.51,65.24 16.51,74.13 10.15,80.48 IC22.27
  Bottom 0.254: v81.28,57.62 104.14,57.62 105.41,58.89 IC17.34 | v82.55,75.4 81.28,76.67 47.62,76.67 45.08,79.21 12.69,79.21 10.79,81.11 IC22.27
RX
  Top 0.254: IC20.12 58.41,34.76 55.88,37.3 IC21.2
RXD
  Top 0.254: IC20.13 55.88,32.22 54.6,30.95 54.6,17.61 53.34,16.34 X1.3
TX
  Top 0.254: IC20.11 60.95,34.76 62.22,36.03 62.22,39.84 62.86,40.48 66.04,40.48 66.04,39.84 IC21.6
TXD
  Top 0.254: IC20.14 53.97,34.12 55.24,35.39 56.51,35.39 57.14,34.76 57.14,16.98 56.51,16.34 X1.2
VCC
  Top 0.508: R3.2 88.26,10.63 86.99,10.63 R12.2 86.36,11.27 85.09,12.54 85.09,13.17 IC27.10 83.18,12.54 81.91,11.27 | 81.91,11.27 81.91,6.82 83.18,5.55 R9.2 | 81.91,11.27 81.91,21.42 83.18,22.7 IC27.14 83.81,23.96 83.81,25.23 BYP27.1 83.81,26.5 83.81,34.76 81.28,37.3 IC21.12 | IC17.36 106.04,63.34 106.04,62.06 IC17.35 107.31,60.8 108.58,59.52 108.58,55.08 109.22,54.45 BYP28.1 | R5.2 101.59,78.58 101.59,77.3 R8.2 101.59,76.03 101.59,27.14 | R2.2 99.06,18.88 99.06,20.15 R1.2 99.69,20.79 101.59,22.7 BYP17.1 101.59,23.96 101.59,27.14 | 101.59,27.14 107.95,27.14 108.58,27.77 108.58,29.68 109.22,30.31 BYP19.1 | 117.47,41.74 118.74,43.02 IC19.16 | 117.47,41.74 117.47,21.42 IC18.14 | 117.47,41.74 117.47,64.61 118.74,65.88 IC28.16 | R6.2 88.9,54.45 90.17,55.71 90.17,56.35 IC17.8 | IC23.27 50.79,83.02 50.79,83.66 R7.2 | BYP23.1 46.35,81.75 47.62,81.75 IC23.28 48.25,80.48 48.25,74.13 | 48.25,74.13 48.25,67.78 IC23.1 48.25,65.24 46.98,63.97 46.98,32.85 | 48.25,74.13 54.6,67.78 54.6,60.16 55.88,58.89 JP2.2 | BYP21.1 50.79,37.94 50.79,37.3 48.25,34.76 IC20.16 47.62,32.85 46.98,32.85 | BYP20.1 43.17,21.42 43.17,22.7 C10.1 43.17,23.96 43.17,32.85 46.98,32.85 | IC24.22 34.92,11.27 33.65,12.54 33.65,13.81 34.92,15.08 IC24.24 | IC26.20 15.23,29.04 15.23,30.31 BYP26.1 | BYP22.1 5.71,81.75 6.98,81.75 IC22.28 7.62,80.48 6.34,79.21 6.34,63.97 7.62,62.7 JP4.2 | IC25.20 15.23,56.98 15.23,58.25 BYP25.1 | CORE-IO.9 2.54,32.85 4.44,30.95 CORE-IO.12
  Bottom 0.508: 74.29,36.66 73.02,36.66 71.75,37.94 IC21.8 70.48,37.94 69.21,36.66 52.7,36.66 51.43,37.94 50.79,37.94 BYP21.1 | 74.29,36.66 75.56,37.94 IC21.10 | 74.29,36.66 79.37,36.66 80.64,37.94 IC21.12 | IC27.4 77.47,15.71 80.01,13.17 82.55,13.17 IC27.10 | BYP18.1 106.04,10.63 102.23,6.82 89.53,6.82 86.99,4.28 85.72,4.28 84.45,5.55 R9.2 | IC28.16 118.11,66.51 116.84,65.24 109.22,65.24 107.95,63.97 IC17.36 | IC18.14 115.56,20.79 114.3,22.06 103.5,22.06 102.23,23.33 BYP17.1 | IC27.14 85.09,23.33 87.62,20.79 98.42,20.79 R1.2 | IC23.27 50.16,81.11 48.89,81.11 IC23.28 | IC17.8 90.17,56.35 55.88,56.35 JP2.2 | R14.2 17.78,6.18 19.05,7.46 19.68,7.46 IC24.20 21.59,8.09 24.12,10.63 34.28,10.63 IC24.22 | BYP20.1 42.54,20.79 37.46,15.71 36.82,15.71 IC24.24 34.92,16.34 21.59,29.68 12.69,29.68 | 12.69,29.68 13.96,28.41 IC26.20 | 11.42,29.68 6.98,29.68 5.71,30.95 CORE-IO.12 | 12.69,29.68 11.42,29.68 | IC22.26 12.06,82.39 10.79,83.66 9.52,83.66 8.25,82.39 IC22.28 | 15.23,60.8 8.25,60.8 JP4.2 | 15.23,60.8 22.86,60.8 24.76,58.89 BYP24.1 | 15.23,60.8 15.23,59.52 BYP25.1 | 11.42,29.68 11.42,56.35 13.96,56.35 IC25.20
VMA  (via drill 0.61)
  Top 0.254: v98.42,48.73 95.88,51.27 v95.88,62.7
  Bottom 0.254: v98.42,48.73 104.14,48.73 105.41,47.46 123.19,47.46 123.19,10 122.55,9.36 119.38,9.36 118.11,8.09 IC18.9 | v95.88,62.7 94.61,63.97 92.7,63.97 IC17.5

### Text on the board
Top: Component Side
Bottom: Solder side | PA8PDP/VRS
tPlace: RealConsole CORE - Rev.1 | +
tValues: - | +